# EAGLE design eib-64 (EAGLE 9.5.1)
DESIGNER: JON NEWMAN; DESIGN_NAME: EIB-64; REVISION: 1.3
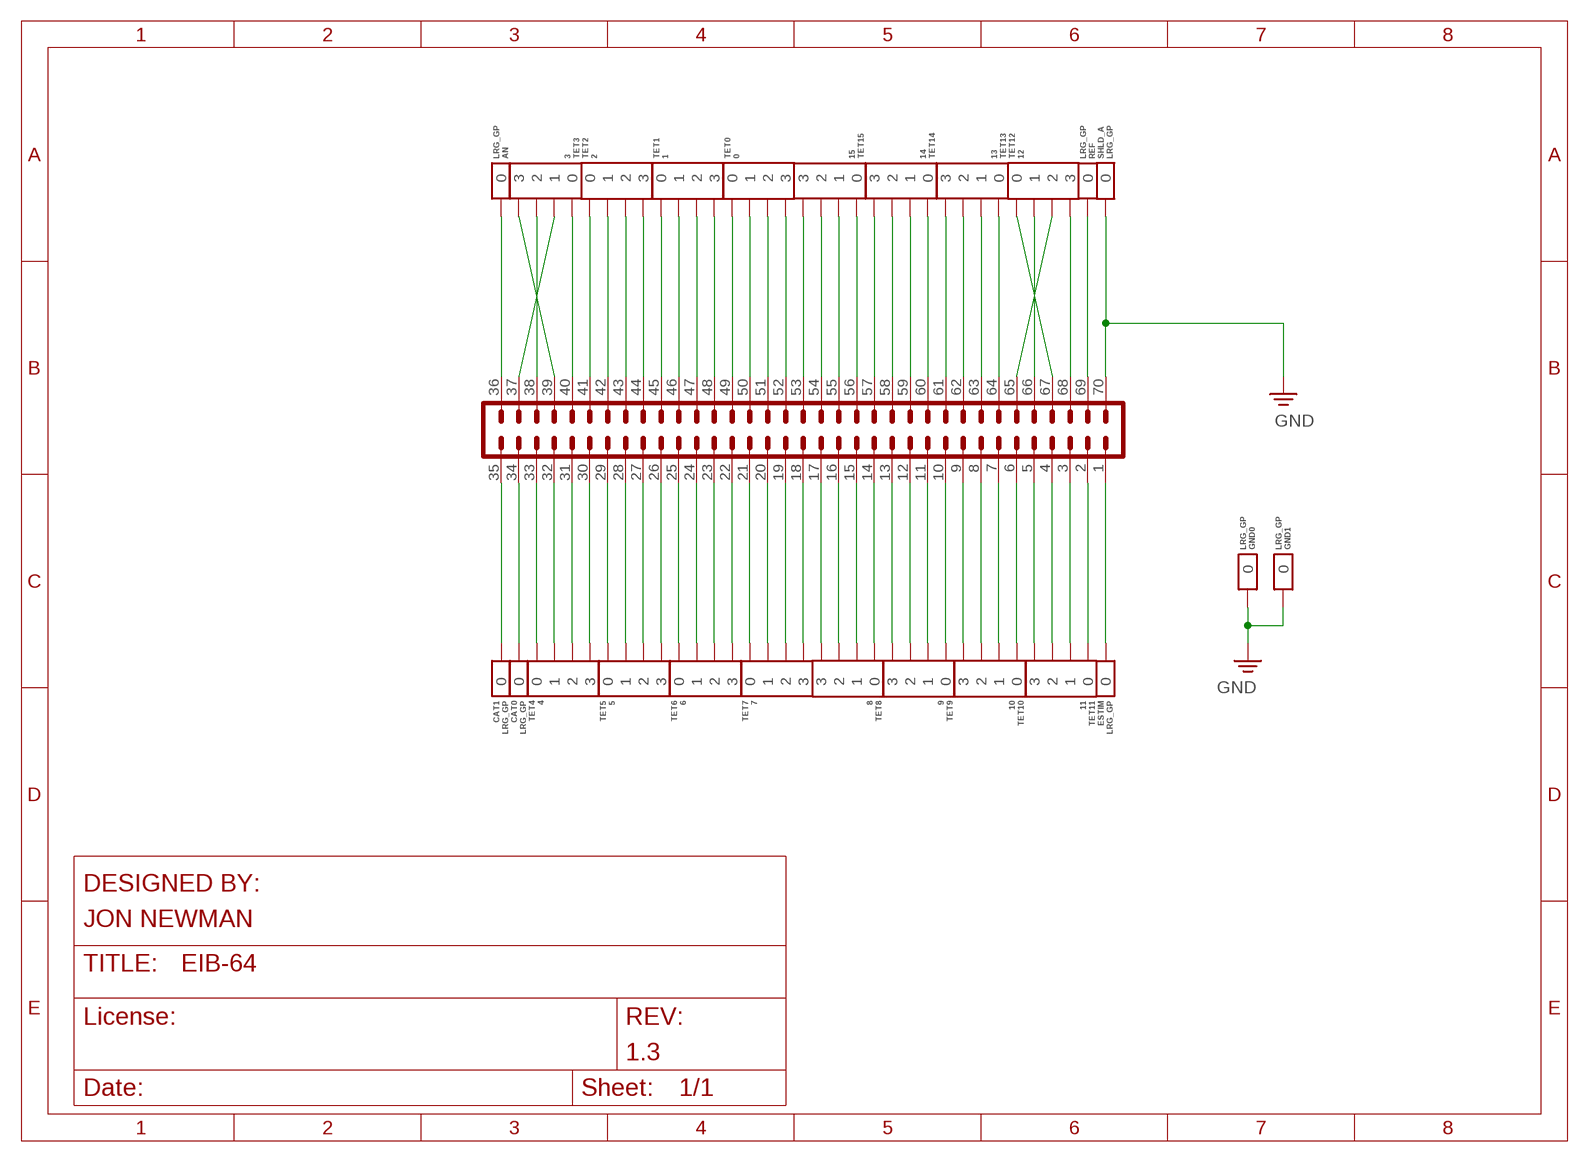
[diagram p0: schematic, sheet 1]

## Parts
AN  LRG_GP  GOLDPIN_0.5ID_0.7OD  [GOLDPIN_0.5ID_0.7OD]
CAT0  LRG_GP  GOLDPIN_0.5ID_0.7OD  [GOLDPIN_0.5ID_0.7OD]
CAT1  LRG_GP  GOLDPIN_0.5ID_0.7OD  [GOLDPIN_0.5ID_0.7OD]
ESTIM  LRG_GP  GOLDPIN_0.5ID_0.7OD  [GOLDPIN_0.5ID_0.7OD]
GND0  LRG_GP  GOLDPIN_0.5ID_0.7OD  [GOLDPIN_0.5ID_0.7OD]
GND1  LRG_GP  GOLDPIN_0.5ID_0.7OD  [GOLDPIN_0.5ID_0.7OD]
J1  DF40-REC  PINHD-2X35_DF40REC  [DF40-70REC]
REF  LRG_GP  GOLDPIN_0.5ID_0.7OD  [GOLDPIN_0.5ID_0.7OD]
SHLD_A  LRG_GP  GOLDPIN_0.5ID_0.7OD  [GOLDPIN_0.5ID_0.7OD]
TET0  0  TETRODE_0.3ID_LINEAR_MOUSE  [TETRODE_0.3ID_LINEAR_MOUSE]
TET1  1  TETRODE_0.3ID_LINEAR_MOUSE  [TETRODE_0.3ID_LINEAR_MOUSE]
TET2  2  TETRODE_0.3ID_LINEAR_MOUSE  [TETRODE_0.3ID_LINEAR_MOUSE]
TET3  3  TETRODE_0.3ID_LINEAR_MOUSE  [TETRODE_0.3ID_LINEAR_MOUSE]
TET4  4  TETRODE_0.3ID_LINEAR_MOUSE  [TETRODE_0.3ID_LINEAR_MOUSE]
TET5  5  TETRODE_0.3ID_LINEAR_MOUSE  [TETRODE_0.3ID_LINEAR_MOUSE]
TET6  6  TETRODE_0.3ID_LINEAR_MOUSE  [TETRODE_0.3ID_LINEAR_MOUSE]
TET7  7  TETRODE_0.3ID_LINEAR_MOUSE  [TETRODE_0.3ID_LINEAR_MOUSE]
TET8  8  TETRODE_0.3ID_LINEAR_MOUSE  [TETRODE_0.3ID_LINEAR_MOUSE]
TET9  9  TETRODE_0.3ID_LINEAR_MOUSE  [TETRODE_0.3ID_LINEAR_MOUSE]
TET10  10  TETRODE_0.3ID_LINEAR_MOUSE  [TETRODE_0.3ID_LINEAR_MOUSE]
TET11  11  TETRODE_0.3ID_LINEAR_MOUSE  [TETRODE_0.3ID_LINEAR_MOUSE]
TET12  12  TETRODE_0.3ID_LINEAR_MOUSE  [TETRODE_0.3ID_LINEAR_MOUSE]
TET13  13  TETRODE_0.3ID_LINEAR_MOUSE  [TETRODE_0.3ID_LINEAR_MOUSE]
TET14  14  TETRODE_0.3ID_LINEAR_MOUSE  [TETRODE_0.3ID_LINEAR_MOUSE]
TET15  15  TETRODE_0.3ID_LINEAR_MOUSE  [TETRODE_0.3ID_LINEAR_MOUSE]

## Nets
AN: AN.P$1 J1.36
CAT0: CAT0.P$1 J1.34
CAT1: CAT1.P$1 J1.35
ESTIM: ESTIM.P$1 J1.1
GND: GND0.P$1 GND1.P$1 J1.70 SHLD_A.P$1
N$1: J1.68 TET12.3
N$2: J1.65 TET12.2
N$3: J1.66 TET12.1
N$4: J1.67 TET12.0
N$5: J1.64 TET13.0
N$6: J1.63 TET13.1
N$7: J1.62 TET13.2
N$8: J1.61 TET13.3
N$9: J1.60 TET14.0
N$10: J1.59 TET14.1
N$11: J1.58 TET14.2
N$12: J1.57 TET14.3
N$13: J1.56 TET15.0
N$14: J1.55 TET15.1
N$15: J1.54 TET15.2
N$16: J1.53 TET15.3
N$17: J1.52 TET0.3
N$18: J1.51 TET0.2
N$19: J1.50 TET0.1
N$20: J1.49 TET0.0
N$21: J1.48 TET1.3
N$22: J1.47 TET1.2
N$23: J1.46 TET1.1
N$24: J1.45 TET1.0
N$25: J1.44 TET2.3
N$26: J1.43 TET2.2
N$27: J1.42 TET2.1
N$28: J1.41 TET2.0
N$29: J1.40 TET3.0
N$30: J1.39 TET3.3
N$31: J1.38 TET3.2
N$32: J1.37 TET3.1
N$33: J1.5 TET11.3
N$34: J1.4 TET11.2
N$35: J1.3 TET11.1
N$36: J1.2 TET11.0
N$199: J1.33 TET4.0
N$200: J1.32 TET4.1
N$201: J1.31 TET4.2
N$202: J1.30 TET4.3
N$203: J1.29 TET5.0
N$204: J1.28 TET5.1
N$205: J1.27 TET5.2
N$206: J1.26 TET5.3
N$207: J1.25 TET6.0
N$208: J1.24 TET6.1
N$209: J1.23 TET6.2
N$210: J1.22 TET6.3
N$211: J1.21 TET7.0
N$212: J1.20 TET7.1
N$213: J1.19 TET7.2
N$214: J1.18 TET7.3
N$215: J1.17 TET8.3
N$216: J1.16 TET8.2
N$217: J1.15 TET8.1
N$218: J1.14 TET8.0
N$219: J1.13 TET9.3
N$220: J1.12 TET9.2
N$221: J1.11 TET9.1
N$222: J1.10 TET9.0
N$223: J1.9 TET10.3
N$224: J1.8 TET10.2
N$225: J1.7 TET10.1
N$226: J1.6 TET10.0
REF: J1.69 REF.P$1

## Library data of the parts
AN CAT0 CAT1 ESTIM GND0 GND1 REF SHLD_A = jonnew:GOLDPIN
J1 = jonnew:PINHD-2X35
TET0 TET1-TET15 = jonnew:TETRODE

## Board
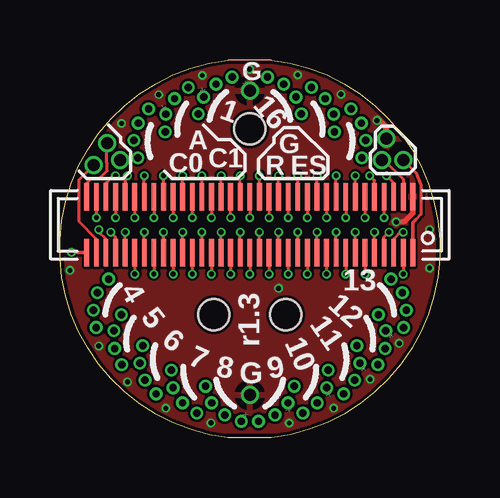
[diagram p1: board, top side]
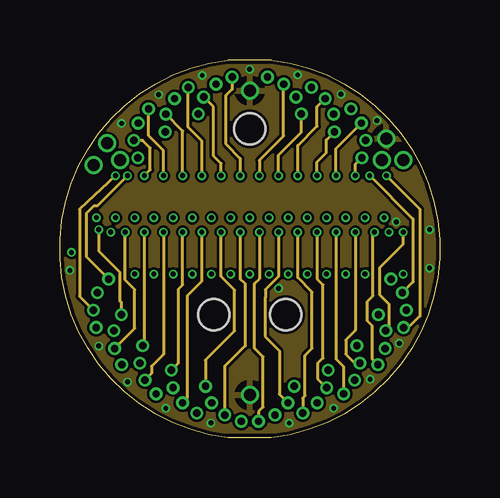
[diagram p2: board, inner layer Route2]
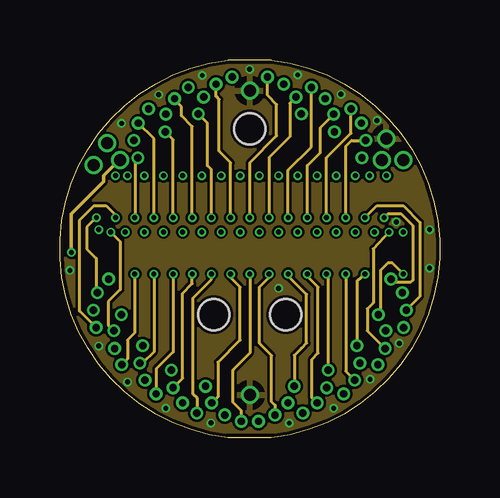
[diagram p3: board, inner layer Route15]
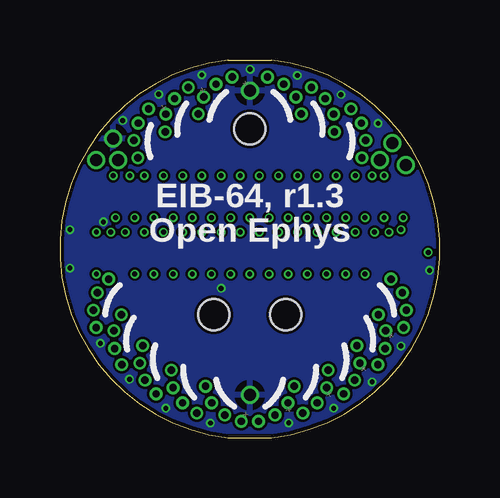
[diagram p4: board, bottom side, seen from below]

Size 15.84 x 15.76 mm. Coordinates in mm from the lower left corner, seen from the top.
Outline: 8.83,0 7.01,0 arc-167 7.01,15.76 8.83,15.76 arc-167 8.83,0
Copper layers (1+2*15+16): Top 0.035mm / dielectric 1.5mm / Route2 0.035mm / dielectric 0.15mm / Route15 0.035mm / dielectric 0.2mm / Bottom 0.035mm
Design rules "pcb-cart-standard-4-layer *": minimum track width 3mil, minimum drill 6mil, track to track 4mil, track to pad 4mil, pad to pad 4mil, via to via 4mil, smd to smd 4mil, copper to edge 6mil, drill to drill 6mil, minimum pad ring 3mil, minimum via ring 3mil, stop-mask expansion 2mil, vias tented up to drill 20mil, thermal gap 10mil
Holes 1.3 mm at 6.42,5.13 9.42,5.13 7.92,12.88
tKeepout: area -0.1,-0.2 to 16,15.9

### Footprints (pad centres in the part's own frame; a part is rotated, then mirrored left to right if it is on the bottom)
GOLDPIN_0.5ID_0.7OD = drill 0.5 pad 0.7: P$1 0,0
DF40-70REC = smd 0.2 x 1.14: 1 -6.8,1.17; 2 -6.4,1.17; 3 -6,1.17; 4 -5.6,1.17; 5 -5.2,1.17; 6 -4.8,1.17; 7 -4.4,1.17; 8 -4,1.17; 9 -3.6,1.17; 10 -3.2,1.17; 11 -2.8,1.17; 12 -2.4,1.17; 13 -2,1.17; 14 -1.6,1.17; 15 -1.2,1.17; 16 -0.8,1.17; 17 -0.4,1.17; 18 0,1.17; 19 0.4,1.17; 20 0.8,1.17; 21 1.2,1.17; 22 1.6,1.17; 23 2,1.17; 24 2.4,1.17; 25 2.8,1.17; 26 3.2,1.17; 27 3.6,1.17; 28 4,1.17; 29 4.4,1.17; 30 4.8,1.17; 31 5.2,1.17; 32 5.6,1.17; 33 6,1.17; 34 6.4,1.17; 35 6.8,1.17; 36 6.8,-1.17; 37 6.4,-1.17; 38 6,-1.17; 39 5.6,-1.17; 40 5.2,-1.17; 41 4.8,-1.17; 42 4.4,-1.17; 43 4,-1.17; 44 3.6,-1.17; 45 3.2,-1.17; 46 2.8,-1.17; 47 2.4,-1.17; 48 2,-1.17; 49 1.6,-1.17; 50 1.2,-1.17; 51 0.8,-1.17; 52 0.4,-1.17; 53 0,-1.17; 54 -0.4,-1.17; 55 -0.8,-1.17; 56 -1.2,-1.17; 57 -1.6,-1.17; 58 -2,-1.17; 59 -2.4,-1.17; 60 -2.8,-1.17; 61 -3.2,-1.17; 62 -3.6,-1.17; 63 -4,-1.17; 64 -4.4,-1.17; 65 -4.8,-1.17; 66 -5.2,-1.17; 67 -5.6,-1.17; 68 -6,-1.17; 69 -6.4,-1.17; 70 -6.8,-1.17
TETRODE_0.3ID_LINEAR_MOUSE = drill 0.305 pad 0.533: 0 2,5.68; 1 1.76,6.38; 2 1.23,6.9; 3 0.55,7.18

### Placement (x,y rotation side)
AN  1.97,12.28 0 top
CAT0  1.41,11.37 0 top
CAT1  2.5,11.58 0 top
ESTIM  14.32,11.58 0 top
GND0  7.92,14.48 0 top
GND1  7.92,1.78 0 top
J1  7.92,8.88 180 top
REF  13.42,11.58 0 top
SHLD_A  13.62,12.48 0 top
TET0  7.92,7.88 358.5 bottom
TET1  7.92,7.88 343.5 bottom
TET2  7.92,7.88 328.5 bottom
TET3  7.92,7.88 121.5 top
TET4  7.92,7.88 136.5 top
TET5  7.92,7.88 151.5 top
TET6  7.92,7.88 166.5 top
TET7  7.92,7.88 181.5 top
TET8  7.92,7.88 181.5 bottom
TET9  7.92,7.88 166.5 bottom
TET10  7.92,7.88 151.5 bottom
TET11  7.92,7.88 136.5 bottom
TET12  7.92,7.88 121.5 bottom
TET13  7.92,7.88 328.5 top
TET14  7.92,7.88 343.5 top
TET15  7.92,7.88 358.5 top

### Tracks (layer width: path | path; a pad name or v marks a point on that pad's centre or on a via)
AN
  Top 0.127: AN.P$1 1.95,12.26 1.95,11.47 1.97,11.45 1.97,11.14 1.64,10.81 1.3,10.81 1.12,10.63 J1.36
CAT0
  Top 0.127: J1.34 1.52,8.29 0.79,9.03 0.79,10.75 CAT0.P$1
CAT1  (via drill 0.2)
  Top 0.15: v0.48,7.73 1.1,7.73 J1.35
  Route15 0.15: v0.48,7.73 0.48,9.34 1.82,10.68 1.82,10.93 2.47,11.58 CAT1.P$1
ESTIM
  Top 0.127: ESTIM.P$1 14.85,11.05 15.06,10.54 15.06,9.32 14.85,9.1
  Top 0.15: J1.1 14.72,8.98 14.85,9.1
GND  (via drill 0.2)
  Top 0.2: J1.70 14.72,9.37 14.35,9 v14.03,9
  Top 0.254: SHLD_A.P$1 13.62,12.93 13.22,13.33
  other vias: 1.62,3.83 2.82,2.33 4.42,1.23 6.3,0.62 9.56,0.61 11.42,1.23 12.94,2.44 14.15,3.94 2.57,13.11 4.12,14.31 7.91,15.37 9.92,15.13 11.72,14.33 5.94,15.11 0.42,6.98 15.42,7.08 15.42,8.68 13.22,13.23 9.12,6.23
  pour Bottom (isolate 0.1): -0.63,15.53 16.37,15.53 16.37,0.23 -0.63,0.23
  pour Top (isolate 0.1): -0.63,15.53 16.37,15.53 16.37,0.23 -0.63,0.23
  pour Route15 (isolate 0.1): -0.63,15.53 16.37,15.53 16.37,0.23 -0.63,0.23
  pour Route2 (isolate 0.1): -0.63,15.53 16.37,15.53 16.37,0.23 -0.63,0.23
N$1  (via drill 0.2)
  Top 0.127: J1.68 13.92,10.63 v13.62,10.93
  Route2 0.127: TET12.3 14.54,4.6 15.02,5.08 15.02,9.53 v13.62,10.93
N$2  (via drill 0.2)
  Top 0.127: J1.65 v12.72,9.18
  Route15 0.127: v12.72,9.18 13.22,9.68 14.32,9.68 15.02,8.98 15.02,5.9 TET12.2
N$3  (via drill 0.2)
  Top 0.127: J1.66 13.12,10.73 v12.92,10.93
  Route2 0.127: TET12.1 14.72,6.49 14.72,9.13 v12.92,10.93
N$4  (via drill 0.2)
  Top 0.127: J1.67 v13.52,9.18
  Route15 0.127: TET12.0 13.95,6.48 14.62,6.48 14.72,6.58 14.72,8.85 14.22,9.35 13.69,9.35 v13.52,9.18
N$5  (via drill 0.2)
  Top 0.127: J1.64 v12.32,10.93
  Route2 0.127: v12.32,10.93 12.32,11.4 TET13.0
N$6  (via drill 0.2)
  Top 0.127: J1.63 v11.92,9.18
  Route15 0.127: v11.92,9.18 11.92,12.16 12.16,12.4 TET13.1
N$7  (via drill 0.2)
  Top 0.127: J1.62 v11.52,10.93
  Route2 0.127: v11.52,10.93 11.52,12.07 TET13.2
N$8  (via drill 0.2)
  Top 0.127: J1.61 v11.12,9.18
  Route15 0.127: v11.12,9.18 11.12,11.68 12.14,12.7 TET13.3
N$9  (via drill 0.2)
  Top 0.127: J1.60 v10.72,10.93
  Route2 0.127: TET14.0 11.11,12.41 11.11,11.89 10.72,11.5 v10.72,10.93
N$10  (via drill 0.2)
  Top 0.127: J1.59 v10.32,9.18
  Route15 0.127: TET14.1 10.85,12.93 10.85,11.89 10.32,11.35 v10.32,9.18
N$11  (via drill 0.2)
  Top 0.127: J1.58 v9.92,10.93
  Route2 0.127: v9.92,10.93 9.92,12.19 10.72,12.99 10.72,13.8 TET14.2
N$12  (via drill 0.2)
  Top 0.127: J1.57 v9.52,9.18
  Route15 0.127: v9.52,9.18 9.52,11.16 10.49,12.13 TET14.3
N$13  (via drill 0.2)
  Top 0.127: J1.56 v9.12,10.93
  Route2 0.127: v9.12,10.93 9.12,11.79 10.07,12.74 TET15.0
N$14  (via drill 0.2)
  Top 0.127: J1.55 v8.72,9.18
  Route15 0.127: TET15.1 9.58,13.95 9.58,12.55 8.72,11.69 v8.72,9.18
N$15  (via drill 0.2)
  Top 0.127: J1.54 v8.32,10.93
  Route2 0.127: TET15.2 9.33,12.58 8.32,11.57 v8.32,10.93
N$16  (via drill 0.2)
  Top 0.127: J1.53 v7.92,9.18
  Route15 0.127: v7.92,9.18 7.92,11.47 9.04,12.59 9.04,13.9 8.66,14.28 TET15.3
N$17  (via drill 0.2)
  Top 0.127: J1.52 v7.52,10.93
  Route2 0.127: v7.52,10.93 7.52,11.65 6.93,12.24 6.93,14.28 7.18,14.53 TET0.3
N$18  (via drill 0.2)
  Top 0.127: v7.12,9.18 J1.51
  Route15 0.127: v7.12,9.18 7.12,11.47 6.64,11.96 6.64,14.11 6.51,14.23 TET0.2
N$19  (via drill 0.2)
  Top 0.127: J1.50 v6.72,10.93
  Route2 0.127: v6.72,10.93 6.72,11.44 6.4,11.75 6.4,13.8 TET0.1
N$20  (via drill 0.2)
  Top 0.127: J1.49 v6.32,9.18
  Route15 0.127: TET0.0 6.15,13.12 6.15,11.35 6.32,11.18 v6.32,9.18
N$21  (via drill 0.2)
  Top 0.127: J1.48 v5.92,10.93
  Route2 0.127: v5.92,10.93 5.92,12.38 5.35,12.95 TET1.3
N$22  (via drill 0.2)
  Top 0.127: J1.47 v5.52,9.18
  Route15 0.127: v5.52,9.18 5.52,12.98 5.07,13.43 5.07,13.8 4.78,14.09 TET1.2
N$23  (via drill 0.2)
  Top 0.127: J1.46 v5.12,10.93
  Route2 0.127: v5.12,10.93 5.12,12.8 TET1.1
N$24  (via drill 0.2)
  Top 0.127: J1.45 v4.72,9.18
  Route15 0.127: v4.72,9.18 4.72,12.43 TET1.0
N$25  (via drill 0.2)
  Top 0.127: J1.44 v4.32,10.93
  Route2 0.127: v4.32,10.93 4.32,11.98 3.7,12.6 TET2.3
N$26  (via drill 0.2)
  Top 0.127: J1.43 v3.92,9.18
  Route15 0.127: v3.92,9.18 3.92,12.46 TET2.2
N$27  (via drill 0.2)
  Top 0.127: J1.42 v3.52,10.93
  Route2 0.127: v3.52,10.93 3.77,11.18 3.77,12.08 3.45,12.4 TET2.1
N$28  (via drill 0.2)
  Top 0.127: J1.41 v3.12,9.18
  Route15 0.127: TET2.0 3.16,11.58 3.16,9.21 v3.12,9.18
N$29  (via drill 0.2)
  Top 0.127: v2.82,10.93 2.72,10.83 J1.40
  Route2 0.127: TET3.0 1.12,7.53 1.12,9.38 1.42,9.68 1.57,9.68 v2.82,10.93
N$30  (via drill 0.2)
  Top 0.127: J1.39 v2.32,9.18
  Route15 0.127: TET3.3 0.82,5.29 0.82,9.08 1.42,9.68 1.92,9.68 2.32,9.28 v2.32,9.18
N$31  (via drill 0.2)
  Top 0.127: J1.38 1.92,10.63 2.22,10.93 v2.32,10.93
  Route2 0.127: TET3.2 0.82,5.9 0.82,9.53 v2.32,10.93
N$32  (via drill 0.2)
  Top 0.127: J1.37 v1.52,9.18
  Route15 0.127: TET3.1 1.52,6.04 1.52,7.48 1.12,7.88 1.12,8.78 v1.52,9.18
N$33  (via drill 0.2)
  Top 0.127: J1.5 v13.12,8.58
  Route2 0.127: TET11.3 13.02,3.29 13.02,4.68 12.82,4.88 12.82,5.68 13.06,5.92 13.06,8.52 v13.12,8.58
N$34  (via drill 0.2)
  Top 0.127: J1.4 13.52,8.38 v13.72,8.58
  Route15 0.127: v13.72,8.58 13.07,7.88 13.07,5.63 12.82,5.38 12.82,4.46 TET11.2
N$35  (via drill 0.2)
  Top 0.127: J1.3 13.92,8.29 14.2,8.58 v14.32,8.58
  Route2 0.127: TET11.1 13.72,4.59 13.72,5.58 13.35,5.95 13.35,7.11 14.32,8.08 v14.32,8.58
N$36  (via drill 0.2)
  Top 0.127: J1.2 v14.32,6.83
  Route15 0.127: v14.32,6.83 13.87,7.28 13.67,7.28 13.37,6.98 13.37,5.22 TET11.0
N$199  (via drill 0.2)
  Top 0.127: J1.33 1.92,8.29 1.62,8.59 v1.62,8.68
  Route2 0.127: TET4.0 2.56,5.64 2.49,5.71 2.49,6.91 1.62,7.78 v1.62,8.68
N$200  (via drill 0.2)
  Top 0.127: J1.32 2.32,8.38 v2.12,8.58
  Route15 0.127: v2.12,8.58 2.52,8.18 2.52,6.18 2.02,5.68 2.02,4.69 TET4.1
N$201  (via drill 0.2)
  Top 0.127: J1.31 v2.72,8.58
  Route2 0.127: TET4.2 3.12,4.56 3.12,6.18 2.72,6.58 v2.72,8.58 | v2.72,8.58
N$202  (via drill 0.2)
  Top 0.127: J1.30 v3.12,6.83
  Route15 0.127: v3.12,6.83 3.12,4.38 2.82,4.08 2.82,3.29 TET4.3
N$203  (via drill 0.2)
  Top 0.127: J1.29 v3.52,8.58
  Route2 0.127: v3.52,8.58 3.52,3.91 TET5.0
N$204  (via drill 0.2)
  Top 0.127: J1.28 v3.92,6.83
  Route15 0.127: v3.92,6.83 3.92,3.58 3.45,3.11 TET5.1
N$205  (via drill 0.2)
  Top 0.127: J1.27 v4.32,8.58
  Route2 0.127: TET5.2 3.82,2.67 3.82,2.98 4.32,3.48 v4.32,8.58
N$206  (via drill 0.2)
  Top 0.127: J1.26 v4.72,6.83
  Route15 0.127: v4.72,6.83 4.72,3.58 4.02,2.88 TET5.3
N$207  (via drill 0.2)
  Top 0.127: J1.25 v5.12,8.58
  Route2 0.127: v5.12,8.58 5.12,6.38 4.94,6.2 4.94,3.11 TET6.0
N$208  (via drill 0.2)
  Top 0.127: J1.24 v5.52,6.83
  Route15 0.127: v5.52,6.83 5.52,6.43 5.12,6.02 5.12,2.48 TET6.1
N$209  (via drill 0.2)
  Top 0.127: J1.23 v5.92,8.58
  Route2 0.127: TET6.2 5.32,1.66 5.32,5.93 5.92,6.53 v5.92,8.58
N$210  (via drill 0.2)
  Top 0.127: J1.22 v6.32,6.83
  Route15 0.127: 5.71,1.66 5.55,1.82 5.55,5.84 6.32,6.6 v6.32,6.83 | 5.71,1.66 | 5.71,1.66 TET6.3
N$211  (via drill 0.2)
  Top 0.127: J1.21 v6.72,8.58
  Route2 0.127: v6.72,8.58 6.72,6.73 7.29,6.16 7.29,4.45 6.07,3.24 TET7.0
N$212  (via drill 0.2)
  Top 0.127: J1.20 v7.12,6.83
  Route15 0.127: v7.12,6.83 7.12,6.68 7.52,6.28 7.52,4.08 6.59,3.15 6.59,1.71 TET7.1
N$213  (via drill 0.2)
  Top 0.127: J1.19 v7.52,8.58
  Route2 0.127: v7.52,8.58 7.52,6.63 7.72,6.43 7.72,3.83 6.87,2.98 TET7.2
N$214  (via drill 0.2)
  Top 0.127: J1.18 v7.92,6.83
  Route15 0.127: v7.92,6.83 7.92,3.53 7.22,2.83 7.22,1.47 7.56,1.13 TET7.3 | TET7.3
N$215  (via drill 0.2)
  Top 0.127: J1.17 v8.32,8.58
  Route2 0.127: v8.32,8.58 8.32,6.63 8.12,6.43 8.12,3.73 8.47,3.38 8.47,1.28 8.28,1.09 | 8.28,1.09 | 8.28,1.09 TET8.3
N$216  (via drill 0.2)
  Top 0.127: J1.16 v8.72,6.83
  Route15 0.127: v8.72,6.83 8.72,6.68 8.32,6.28 8.32,3.94 8.83,3.43 8.83,1.49 8.97,1.36 TET8.2 | TET8.2
N$217  (via drill 0.2)
  Top 0.127: J1.15 v9.12,8.58
  Route2 0.127: v9.12,8.58 9.12,6.73 8.57,6.18 8.57,5.85 8.55,5.84 8.55,4.23 9.15,3.63 9.15,1.81 TET8.1
N$218  (via drill 0.2)
  Top 0.127: J1.14 v9.52,6.83
  Route15 0.127: v9.52,6.83 9.52,6.74 10.29,5.98 10.29,3.95 10.07,3.73 9.77,3.43 TET8.0
N$219  (via drill 0.2)
  Top 0.127: J1.13 v9.92,8.58
  Route2 0.127: 10.13,1.66 10.22,1.75 10.22,3.43 10.52,3.73 10.52,6.08 9.92,6.68 v9.92,8.58 | 10.13,1.66 | 10.13,1.66 TET9.3
N$220  (via drill 0.2)
  Top 0.127: J1.12 v10.32,6.83
  Route15 0.127: v10.32,6.83 10.32,6.73 10.77,6.28 10.77,3.53 10.51,3.27 10.51,1.67 TET9.2
N$221  (via drill 0.2)
  Top 0.127: J1.11 v10.72,8.58
  Route2 0.127: v10.72,8.58 10.72,6.63 10.97,6.38 10.97,3.33 10.74,3.1 10.74,2.46 TET9.1
N$222  (via drill 0.2)
  Top 0.127: J1.10 v11.12,6.83
  Route15 0.127: TET9.0 11.19,6.76 v11.12,6.83
N$223  (via drill 0.2)
  Top 0.127: J1.9 v11.52,8.58
  Route2 0.127: v11.52,8.58 11.52,3.28 11.83,2.97 TET10.3
N$224  (via drill 0.2)
  Top 0.127: J1.8 v11.92,6.83
  Route15 0.127: v11.92,6.83 11.92,2.77 TET10.2
N$225  (via drill 0.2)
  Top 0.127: J1.7 v12.32,8.58
  Route2 0.127: v12.32,8.58 12.32,4.48 11.92,4.08 11.92,3.48 12.29,3.11 TET10.1
N$226  (via drill 0.2)
  Top 0.127: J1.6 v12.72,6.83
  Route15 0.127: v12.72,6.83 12.39,6.55 TET10.0
REF
  Top 0.127: REF.P$1 13.52,11.58 14.32,10.78 J1.69

### Text on the board
tPlace: G | 1 | 16 | A | C0 | C1 | R | G | ES | 13 | 4 | 5 | r1.3 | 11 | 12 | 6 | 10 | 7 | 8 | G | 9
bPlace: EIB-64, r1.3 / Open Ephys